# EAGLE design calibrator-test (EAGLE 9.4.1)
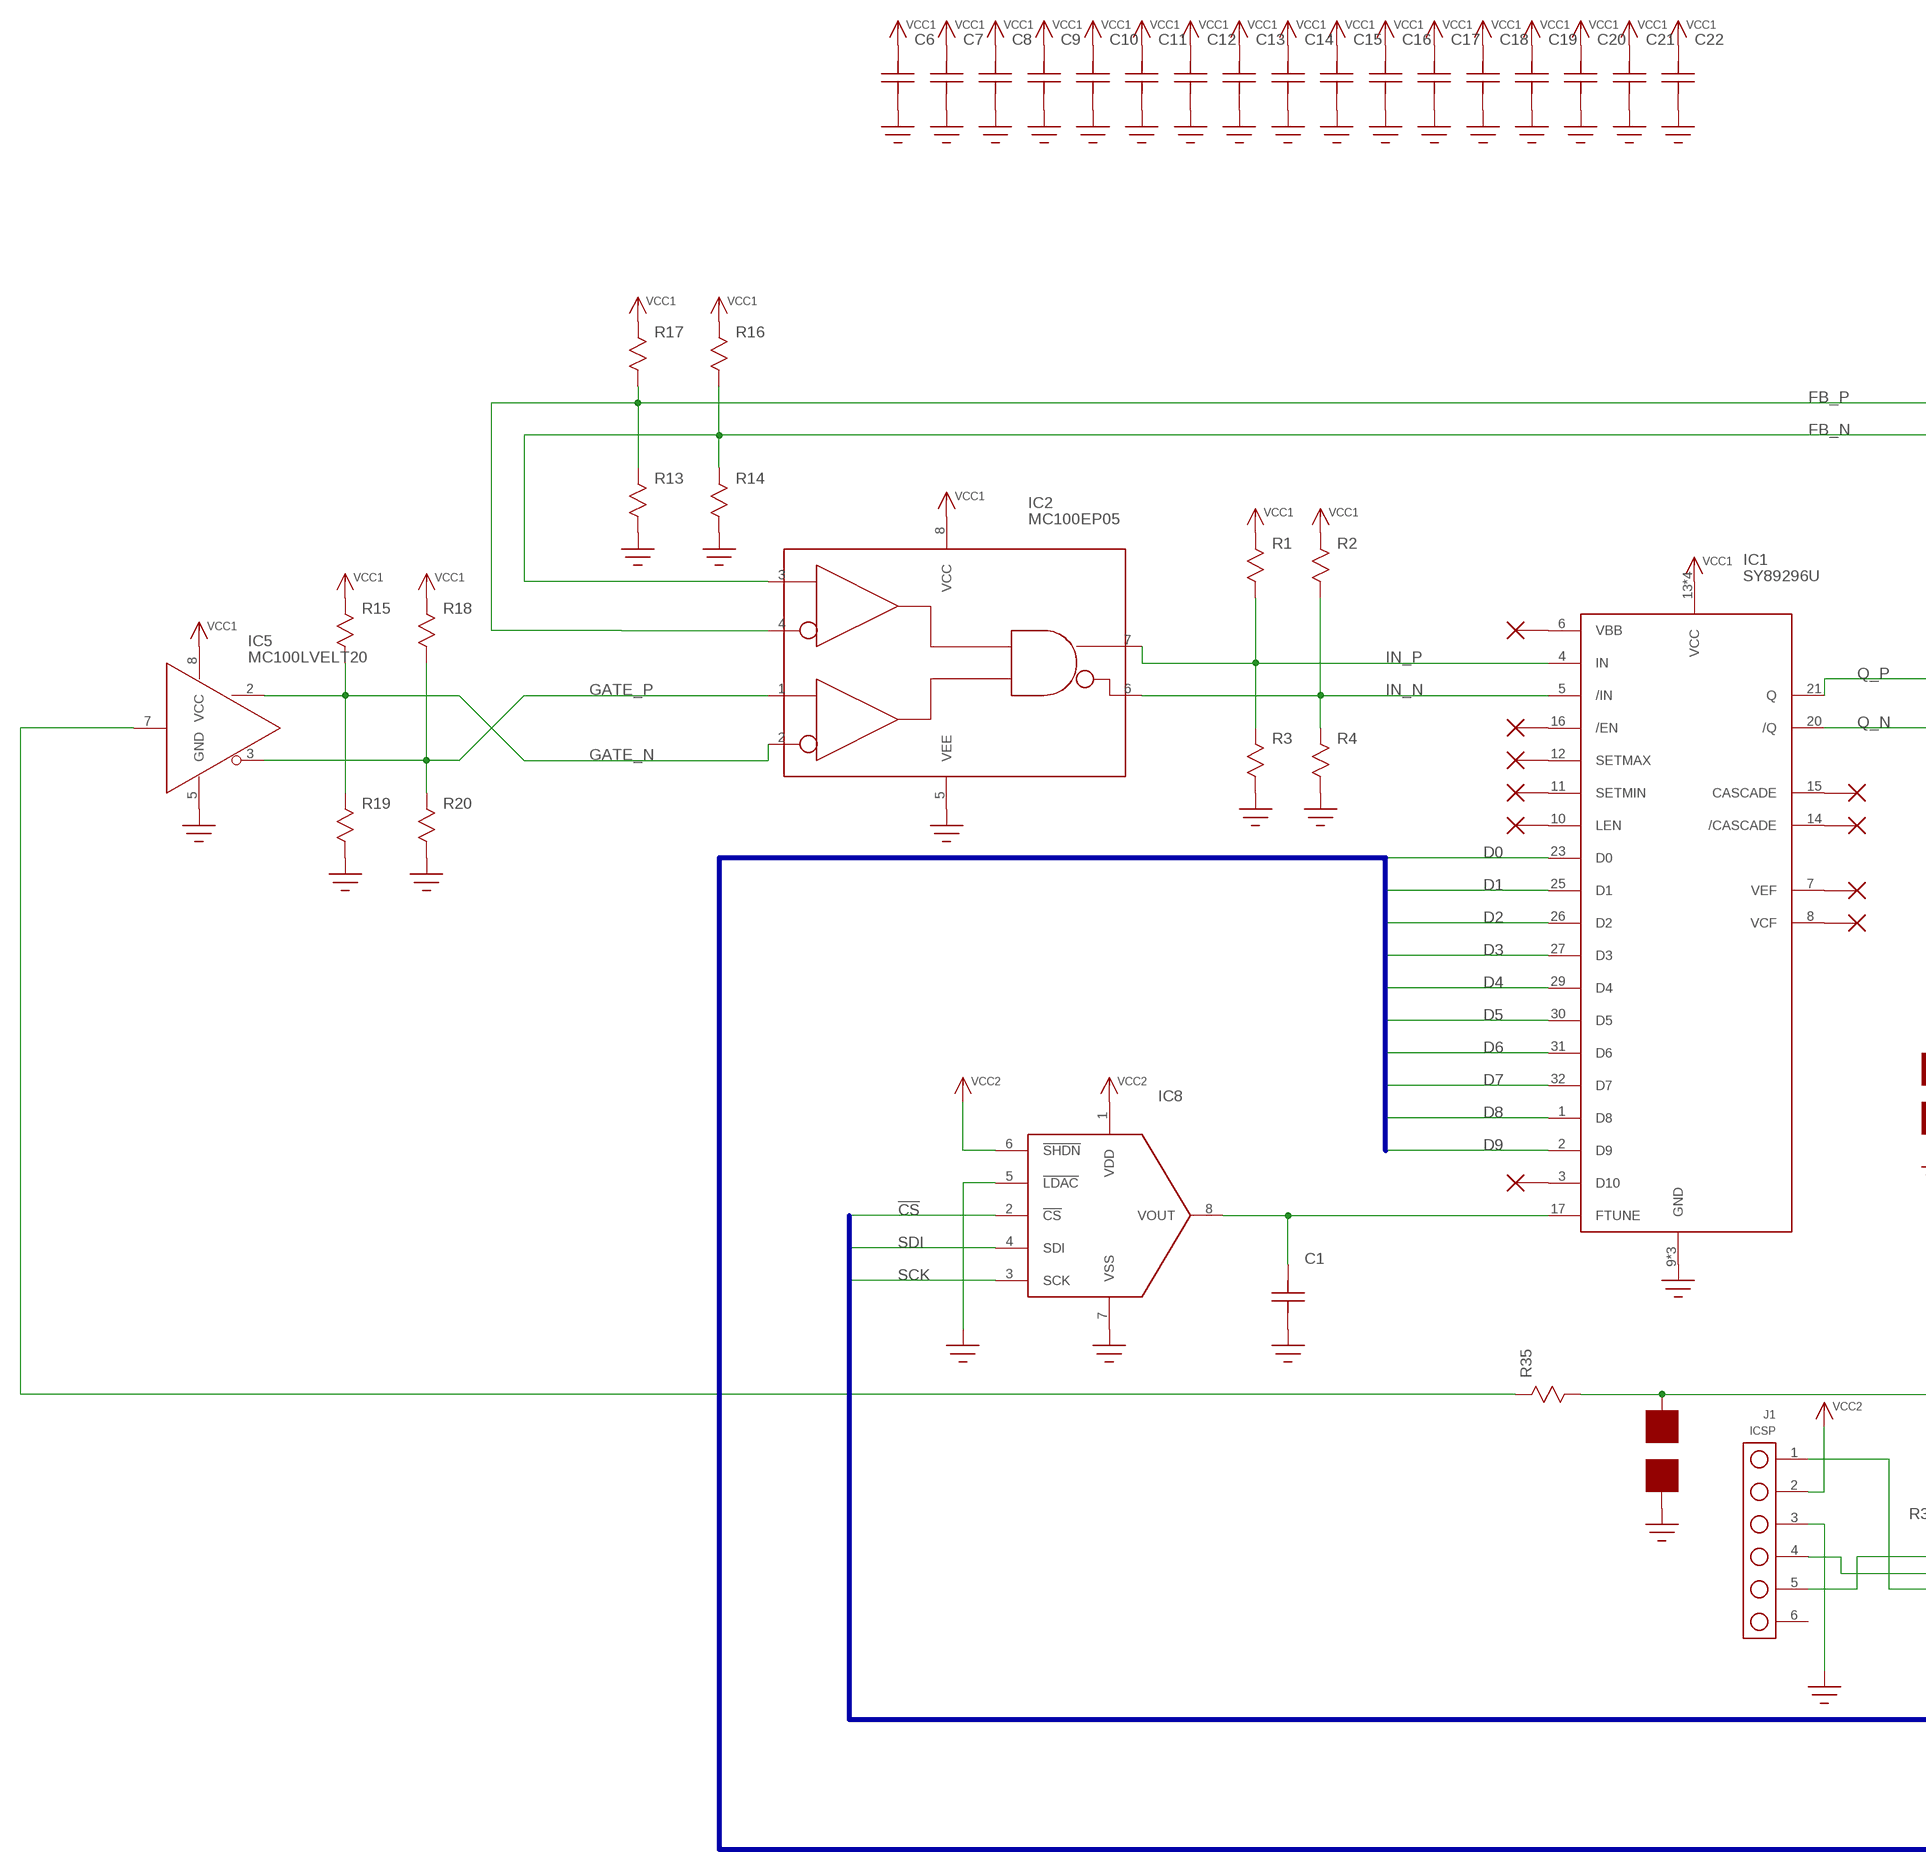
[diagram p0: schematic, sheet 1, part 1 of 2]
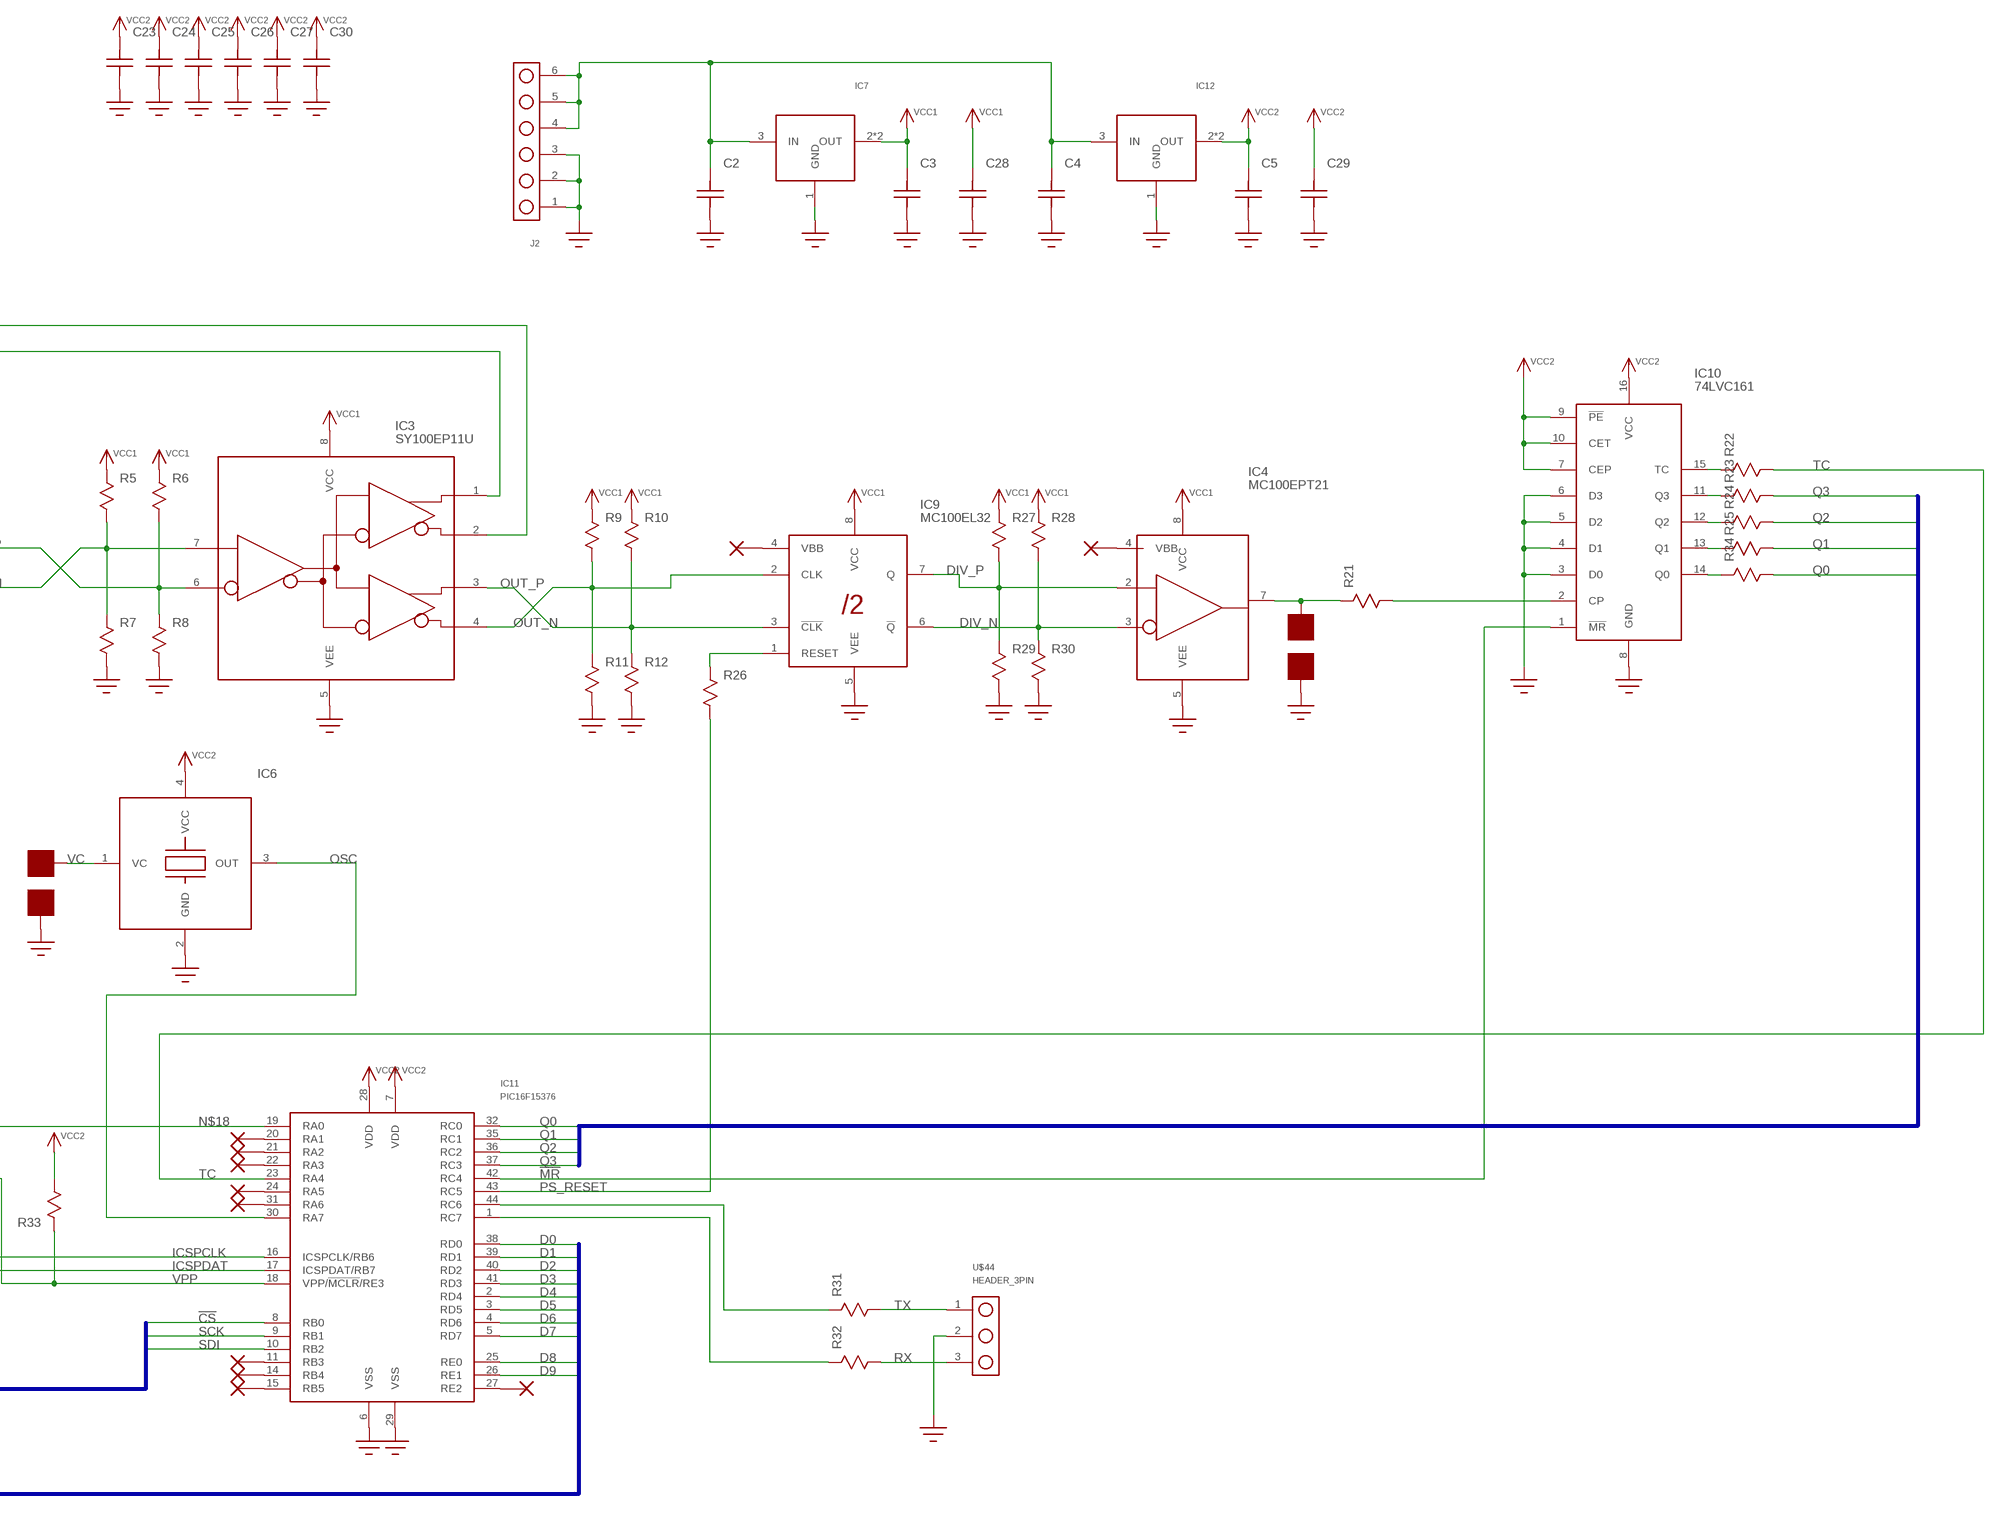
[diagram p1: schematic, sheet 1, part 2 of 2]

## Parts
C1  C0603  [C0603]
C2  C1206  [1206]
C3  C1206  [1206]
C4  C1206  [1206]
C5  C1206  [1206]
C6  C0603  [C0603]
C7  C0603  [C0603]
C8  C0603  [C0603]
C9  C0603  [C0603]
C10  C0603  [C0603]
C11  C0603  [C0603]
C12  C0603  [C0603]
C13  C0603  [C0603]
C14  C0603  [C0603]
C15  C0603  [C0603]
C16  C0603  [C0603]
C17  C0603  [C0603]
C18  C0603  [C0603]
C19  C0603  [C0603]
C20  C0603  [C0603]
C21  C0603  [C0603]
C22  C0603  [C0603]
C23  C0603  [C0603]
C24  C0603  [C0603]
C25  C0603  [C0603]
C26  C0603  [C0603]
C27  C0603  [C0603]
C28  C1206  [1206]
C29  C1206  [1206]
C30  C0603  [C0603]
IC1  SY89296U  [TQFP32_7X7]
IC2  MC100EP05  SY10EP05V  [SOIC8]
IC3  SY100EP11U  SY10EP11U  [SOIC8]
IC4  MC100EPT21  [SOIC8]
IC5  MC100LVELT20  [SOIC8]
IC6  XTAL_OSC_VC  [XTAL_3.2X5]
IC7  AZ1117E  [SOT-223]
IC8  MCP48X1  [SOIC8]
IC9  MC100EL32  [SOIC8]
IC10  74LVC161  74XX161  [SOIC-16]
IC11  PIC16F15376  [TQFP44]
IC12  AZ1117E  [SOT-223]
J1  ICSP  HEADER_6PIN  [HEADER_6PIN]
J2  HEADER_6PIN  [HEADER_6PIN]
R1  R0603  [R0603]
R2  R0603  [R0603]
R3  R0603  [R0603]
R4  R0603  [R0603]
R5  R0603  [R0603]
R6  R0603  [R0603]
R7  R0603  [R0603]
R8  R0603  [R0603]
R9  R0603  [R0603]
R10  R0603  [R0603]
R11  R0603  [R0603]
R12  R0603  [R0603]
R13  R0603  [R0603]
R14  R0603  [R0603]
R15  R0603  [R0603]
R16  R0603  [R0603]
R17  R0603  [R0603]
R18  R0603  [R0603]
R19  R0603  [R0603]
R20  R0603  [R0603]
R21  R0603  [R0603]
R22  R0603  [R0603]
R23  R0603  [R0603]
R24  R0603  [R0603]
R25  R0603  [R0603]
R26  R0603  [R0603]
R27  R0603  [R0603]
R28  R0603  [R0603]
R29  R0603  [R0603]
R30  R0603  [R0603]
R31  R0603  [R0603]
R32  R0603  [R0603]
R33  R0603  [R0603]
R34  R0603  [R0603]
R35  R0603  [R0603]
U$31  NO_CONNECT  (no package)
U$32  NO_CONNECT  (no package)
U$33  NO_CONNECT  (no package)
U$34  NO_CONNECT  (no package)
U$35  NO_CONNECT  (no package)
U$36  NO_CONNECT  (no package)
U$37  NO_CONNECT  (no package)
U$44  HEADER_3PIN  [HEADER_3PIN]
U$48  PAD50MIL  [PAD_50MIL]
U$49  NO_CONNECT  (no package)
U$50  NO_CONNECT  (no package)
U$51  NO_CONNECT  (no package)
U$57  NO_CONNECT  (no package)
U$61  NO_CONNECT  (no package)
U$62  NO_CONNECT  (no package)
U$65  NO_CONNECT  (no package)
U$66  NO_CONNECT  (no package)
U$72  NO_CONNECT  (no package)
U$73  NO_CONNECT  (no package)
U$74  NO_CONNECT  (no package)
U$75  PAD50MIL  [PAD_50MIL]
U$76  PAD50MIL  [PAD_50MIL]
U$77  PAD50MIL  [PAD_50MIL]
U$78  PAD50MIL  [PAD_50MIL]
U$81  PAD50MIL  [PAD_50MIL]
U$84  NO_CONNECT  (no package)
U$85  NO_CONNECT  (no package)
U$86  NO_CONNECT  (no package)

## Nets
!CS!: IC8.2(!CS!) IC11.8(RB0)
!GATE!: IC5.7(D) R35.P$1
!MR!: IC10.1(!MR!) IC11.42(RC4)
D0: IC1.23(D0) IC11.38(RD0)
D1: IC1.25(D1) IC11.39(RD1)
D2: IC1.26(D2) IC11.40(RD2)
D3: IC1.27(D3) IC11.41(RD3)
D4: IC1.29(D4) IC11.2(RD4)
D5: IC1.30(D5) IC11.3(RD5)
D6: IC1.31(D6) IC11.4(RD6)
D7: IC1.32(D7) IC11.5(RD7)
D8: IC1.1(D8) IC11.25(RE0)
D9: IC1.2(D9) IC11.26(RE1)
DIV_N [diff-pair]: IC4.3(!D!) IC9.6(!Q!) R28.P$2 R30.P$1
DIV_P [diff-pair]: IC4.2(D) IC9.7(Q) R27.P$2 R29.P$1
FB_N [diff-pair]: IC2.3(D1) IC3.1(Q0) R14.P$1 R16.P$2
FB_P [diff-pair]: IC2.4(!D1!) IC3.2(!Q0!) R13.P$1 R17.P$2
GATE_N [diff-pair]: IC2.2(!D0!) IC5.2(Q) R15.P$2 R19.P$1
GATE_P [diff-pair]: IC2.1(D0) IC5.3(!Q!) R18.P$2 R20.P$1
GND: C1.P$1 C2.P$1 C3.P$1 C4.P$1 C5.P$1 C6.P$1 C7.P$1 C8.P$1 C9.P$1 C10.P$1 C11.P$1 C12.P$1 C13.P$1 C14.P$1 C15.P$1 C16.P$1 C17.P$1 C18.P$1 C19.P$1 C20.P$1 C21.P$1 C22.P$1 C23.P$1 C24.P$1 C25.P$1 C26.P$1 C27.P$1 C28.P$1 C29.P$1 C30.P$1 IC1.9(GND) IC1.24(GND) IC1.28(GND) IC2.5(VEE) IC3.5(VEE) IC4.5(VEE) IC5.5(GND) IC6.2(GND) IC7.1(GND) IC8.5(!LDAC!) IC8.7(VSS) IC9.5(VEE) IC10.3(D0) IC10.4(D1) IC10.5(D2) IC10.6(D3) IC10.8(GND) IC11.6(VSS) IC11.29(VSS) IC12.1(GND) J1.3 J2.1 J2.2 J2.3 R3.P$2 R4.P$2 R7.P$2 R8.P$2 R11.P$2 R12.P$2 R13.P$2 R14.P$2 R19.P$2 R20.P$2 R29.P$2 R30.P$2 U$44.2 U$76.P$1 U$78.P$1 U$81.P$1
ICSPCLK: IC11.16(ICSPCLK/RB6) J1.5
ICSPDAT: IC11.17(ICSPDAT/RB7) J1.4
IN_N [diff-pair]: IC1.5(/IN) IC2.6(!Q!) R2.P$2 R4.P$1
IN_P [diff-pair]: IC1.4(IN) IC2.7(Q) R1.P$2 R3.P$1
N$1: IC1.3(D10) U$37.P$1
N$2: IC1.10(LEN) U$36.P$1
N$3: IC1.11(SETMIN) U$84.P$1
N$4: IC1.12(SETMAX) U$85.P$1
N$5: IC1.16(/EN) U$86.P$1
N$6: IC10.2(CP) R21.P$2
N$7: IC10.15(TC) R22.P$1
N$8: IC10.11(Q3) R23.P$1
N$9: IC10.12(Q2) R24.P$1
N$10: IC9.4(VBB) U$65.P$1
N$11: IC1.7(VEF) U$31.P$1
N$12: IC1.8(VCF) U$32.P$1
N$13: IC1.14(/CASCADE) U$33.P$1
N$14: IC1.15(CASCADE) U$34.P$1
N$15: IC1.6(VBB) U$35.P$1
N$16: IC10.13(Q1) R25.P$1
N$17: IC10.14(Q0) R34.P$1
N$18: IC11.19(RA0) R35.P$2 U$75.P$1
N$20: IC11.44(RC6) R31.P$1
N$21: IC11.1(RC7) R32.P$1
N$23: C2.P$2 C4.P$2 IC7.3(IN) IC12.3(IN) J2.4 J2.5 J2.6
N$24: IC11.20(RA1) U$49.P$1
N$25: IC11.21(RA2) U$50.P$1
N$26: IC11.22(RA3) U$57.P$1
N$27: IC11.24(RA5) U$61.P$1
N$28: IC4.4(VBB) U$51.P$1
N$29: C1.P$2 IC1.17(FTUNE) IC8.8(VOUT)
N$32: IC11.31(RA6) U$62.P$1
N$34: IC9.1(RESET) R26.P$1
N$36: IC4.7(Q) R21.P$1 U$77.P$1
N$37: IC11.11(RB3) U$66.P$1
N$38: IC11.14(RB4) U$72.P$1
N$39: IC11.15(RB5) U$73.P$1
N$40: IC11.27(RE2) U$74.P$1
OSC: IC6.3(OUT) IC11.30(RA7)
OUT_N [diff-pair]: IC3.4(!Q1!) IC9.2(CLK) R9.P$2 R11.P$1
OUT_P [diff-pair]: IC3.3(Q1) IC9.3(!CLK!) R10.P$2 R12.P$1
PS_RESET: IC11.43(RC5) R26.P$2
Q0: IC11.32(RC0) R34.P$2
Q1: IC11.35(RC1) R25.P$2
Q2: IC11.36(RC2) R24.P$2
Q3: IC11.37(RC3) R23.P$2
Q_N [diff-pair]: IC1.20(/Q) IC3.7(D) R5.P$2 R7.P$1
Q_P [diff-pair]: IC1.21(Q) IC3.6(!D!) R6.P$2 R8.P$1
RX: R32.P$2 U$44.3
SCK: IC8.3(SCK) IC11.9(RB1)
SDI: IC8.4(SDI) IC11.10(RB2)
TC: IC11.23(RA4) R22.P$2
TX: R31.P$2 U$44.1
VC: IC6.1(VC) U$48.P$1
VCC1: C3.P$2 C6.P$2 C7.P$2 C8.P$2 C9.P$2 C10.P$2 C11.P$2 C12.P$2 C13.P$2 C14.P$2 C15.P$2 C16.P$2 C17.P$2 C18.P$2 C19.P$2 C20.P$2 C21.P$2 C22.P$2 C28.P$2 IC1.13(VCC) IC1.18(VCC) IC1.19(VCC) IC1.22(VCC) IC2.8(VCC) IC3.8(VCC) IC4.8(VCC) IC5.8(VCC) IC7.2(OUT) IC7.4(OUT) IC9.8(VCC) R1.P$1 R2.P$1 R5.P$1 R6.P$1 R9.P$1 R10.P$1 R15.P$1 R16.P$1 R17.P$1 R18.P$1 R27.P$1 R28.P$1
VCC2: C5.P$2 C23.P$2 C24.P$2 C25.P$2 C26.P$2 C27.P$2 C29.P$2 C30.P$2 IC6.4(VCC) IC8.1(VDD) IC8.6(!SHDN!) IC10.7(CEP) IC10.9(!PE!) IC10.10(CET) IC10.16(VCC) IC11.7(VDD) IC11.28(VDD) IC12.2(OUT) IC12.4(OUT) J1.2 R33.P$2
VPP: IC11.18(VPP/!MCLR!/RE3) J1.1 R33.P$1
Unconnected: J1.6

## Buses
D0,D1,D2,D3,D4,D5,D6,D7,D8,D9
Q0,Q1,Q2,Q3
!CS!,SCK,SDI

## Library data of the parts
C1-C30 = yapo:C
IC1 = yapo:SY89296U
IC2 = yapo:SY10EP05V
IC3 = yapo:SY10EP11U
IC4 = yapo:MC100EPT21
IC5 = yapo:MC100LVELT20
IC6 = yapo:XTAL_OSC_VC
IC7 IC12 = yapo:AZ1117E
IC8 = yapo:MCP48X1
IC9 = yapo:MC100EL32
IC10 = yapo:74XX161
IC11 = yapo:PIC16F15376
J1 J2 = yapo:HEADER_6PIN
R1-R35 = yapo:R
U$31-U$37 U$49-U$51 U$57 U$61 U$62 U$65 U$66 U$72-U$74 U$84-U$86 = yapo:NO_CONNECT
U$44 = yapo:HEADER_3PIN
U$48 U$75-U$78 U$81 = yapo:PAD

## Net classes
1 diff-pair: width 0.356 mm, clearance 0.254 mm

## Board
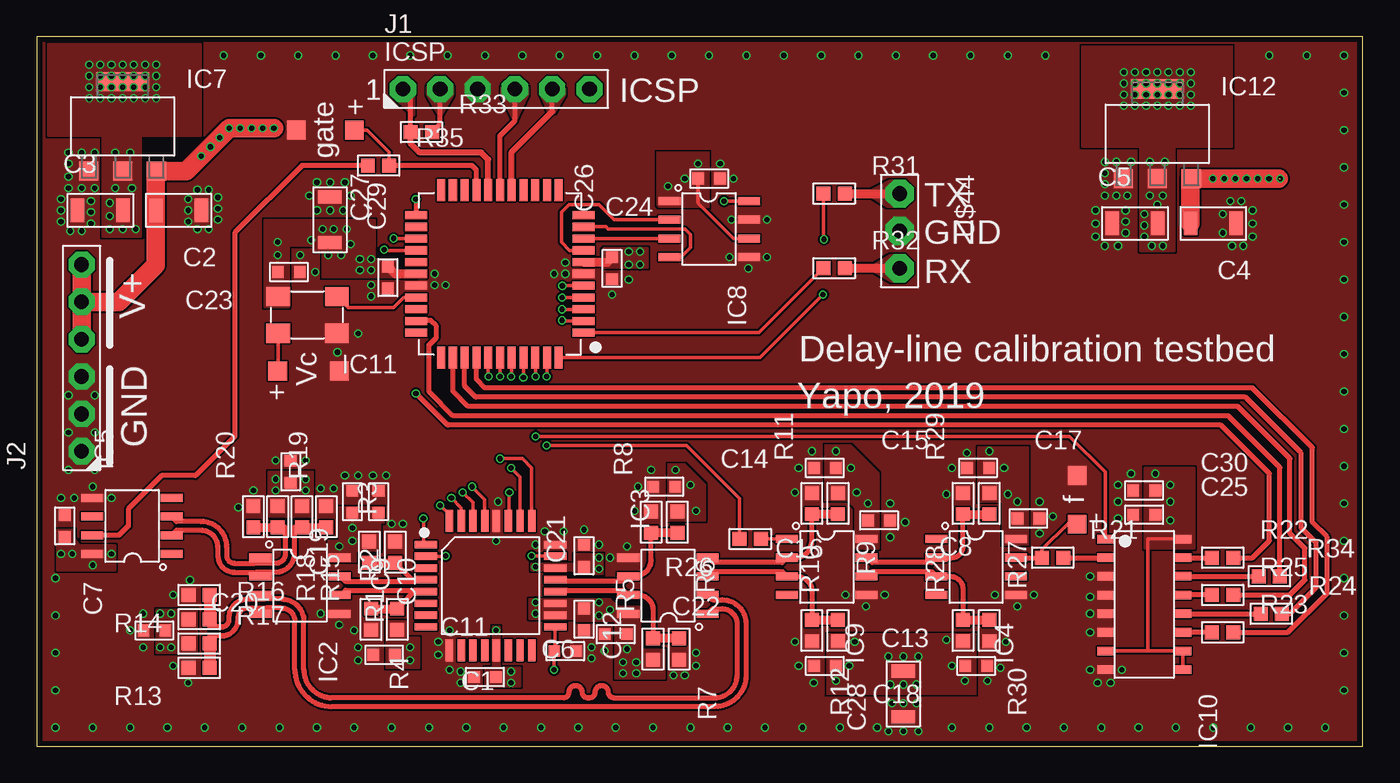
[diagram p2: board, top side]
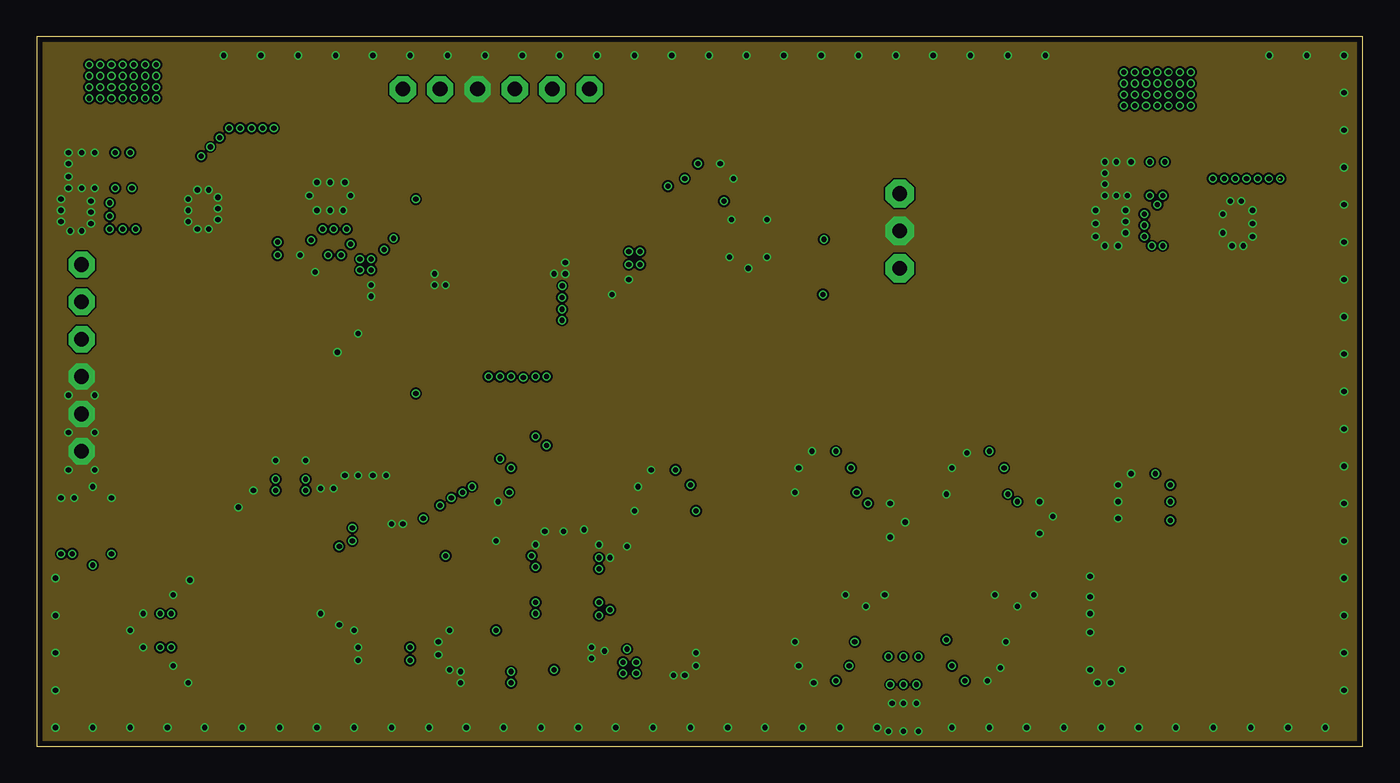
[diagram p3: board, inner layer Route2]
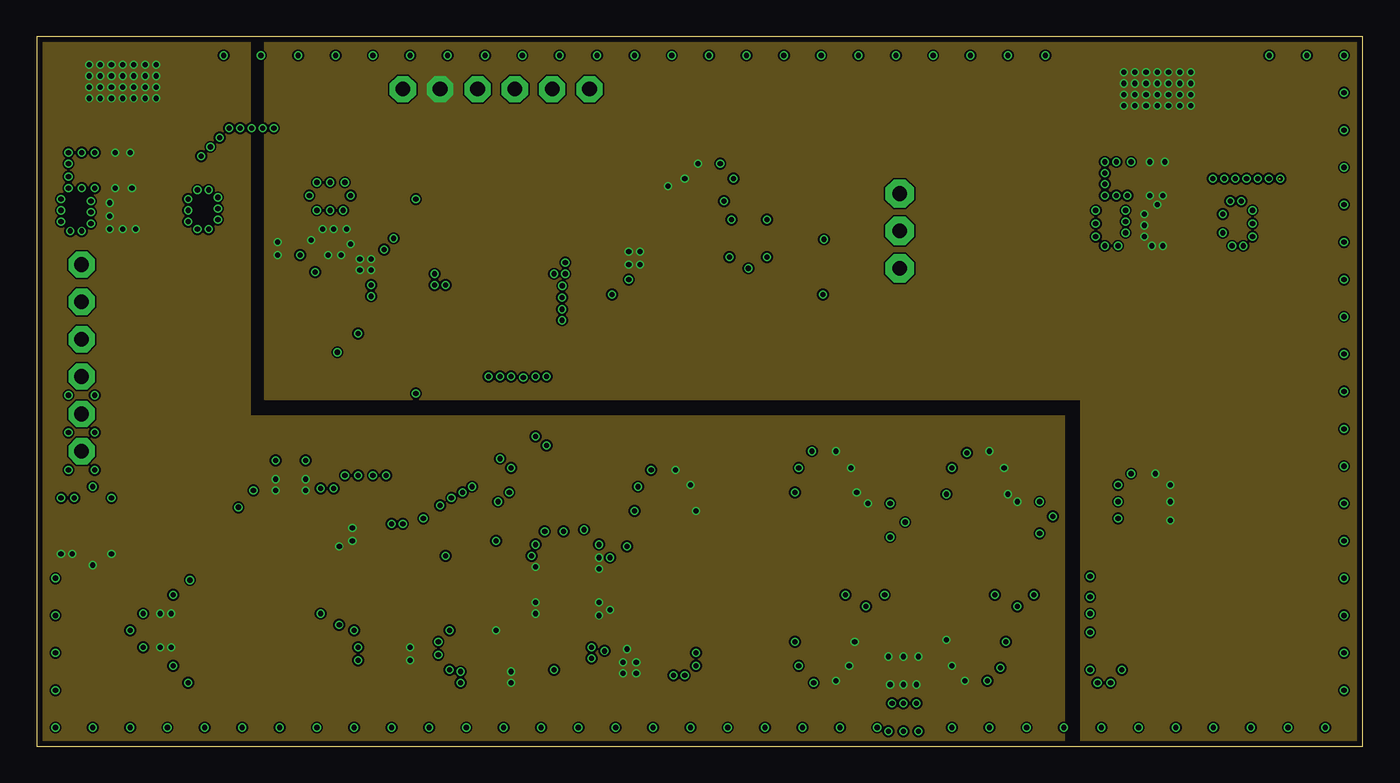
[diagram p4: board, inner layer Route15]
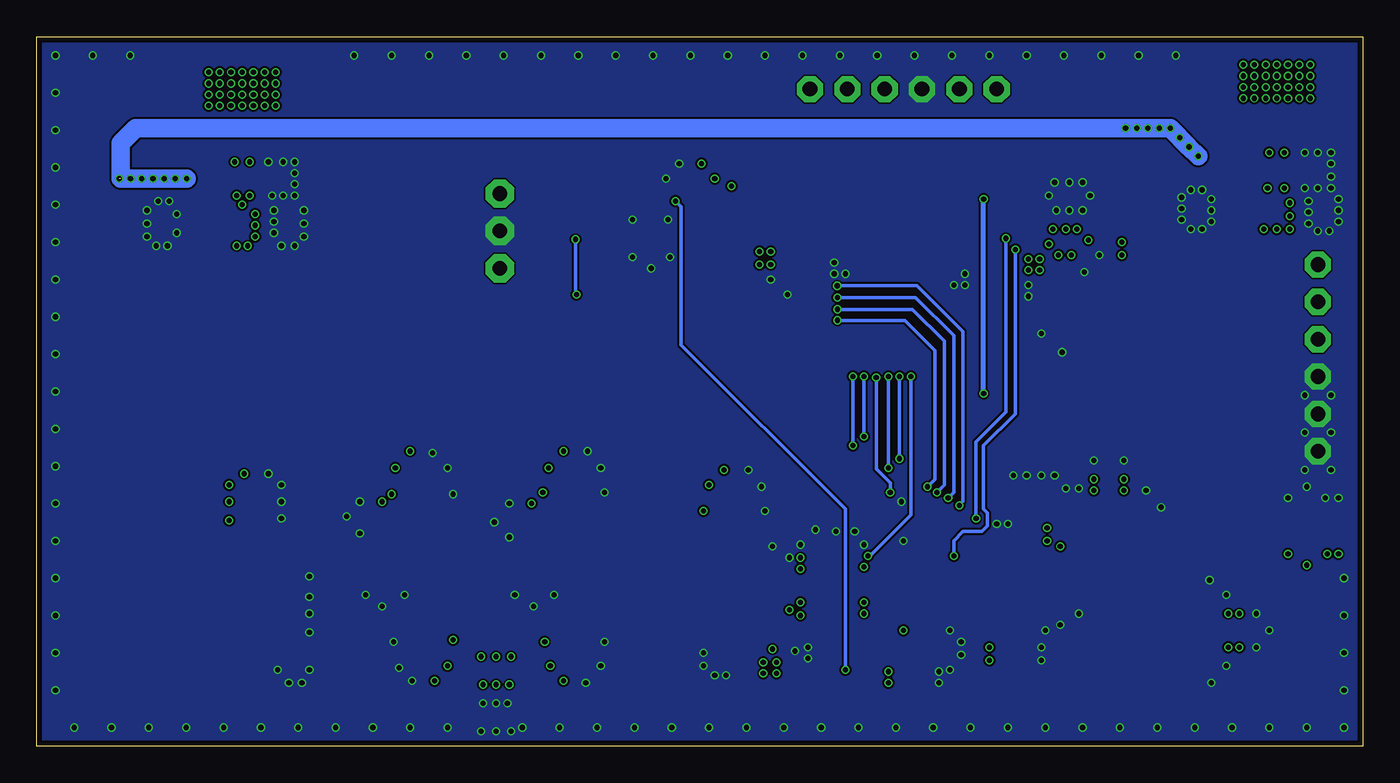
[diagram p5: board, bottom side, seen from below]

Size 90.17 x 48.26 mm. Coordinates in mm from the lower left corner, seen from the top.
Outline: 0,0 90.17,0 90.17,48.26 0,48.26 0,0
Copper layers (1*2*15*16): Top 0.035559375mm / dielectric 0.17018125mm / Route2 0.01778125mm / dielectric 47mil / Route15 0.01778125mm / dielectric 0.17018125mm / Bottom 0.035559375mm
Design rules "oshpark-4layer *": minimum track width 5mil, minimum drill 10mil, track to track 5mil, track to pad 5mil, pad to pad 5mil, via to via 5mil, smd to smd 5mil, copper to edge 15mil, drill to drill 6mil, minimum pad ring 4mil, minimum via ring 4mil, stop-mask expansion 2.5mil, vias tented up to drill 20mil, thermal gap 10mil

### Footprints (pad centres in the part's own frame; a part is rotated, then mirrored left to right if it is on the bottom)
C0603 = smd 0.8 x 0.8: P$1 -0.75,0; P$2 0.75,0
1206 = smd 0.9 x 1.6: P$1 -1.55,0; P$2 1.55,0
TQFP32_7X7 = smd 1.5 x 0.5: 1 -4.4,2.8; 2 -4.4,2; 3 -4.4,1.2; 4 -4.4,0.4; 5 -4.4,-0.4; 6 -4.4,-1.2; 7 -4.4,-2; 8 -4.4,-2.8; 17 4.4,-2.8; 18 4.4,-2; 19 4.4,-1.2; 20 4.4,-0.4; 21 4.4,0.4; 22 4.4,1.2; 23 4.4,2; 24 4.4,2.8 | smd 0.5 x 1.5: 9 -2.8,-4.4; 10 -2,-4.4; 11 -1.2,-4.4; 12 -0.4,-4.4; 13 0.4,-4.4; 14 1.2,-4.4; 15 2,-4.4; 16 2.8,-4.4; 25 2.8,4.4; 26 2,4.4; 27 1.2,4.4; 28 0.4,4.4; 29 -0.4,4.4; 30 -1.2,4.4; 31 -2,4.4; 32 -2.8,4.4
SOIC8 = smd 0.55 x 1.5: 1 -1.905,-2.7; 2 -0.635,-2.7; 3 0.635,-2.7; 4 1.905,-2.7; 5 1.905,2.7; 6 0.635,2.7; 7 -0.635,2.7; 8 -1.905,2.7
XTAL_3.2X5 = smd 1.6 x 1.3: 1 -2,-1.25; 2 2,-1.25; 3 2,1.25; 4 -2,1.25
SOT-223 = smd 1.3 x 1.3: 1 -2.3,-3.05; 2 0,-3.05; 3 2.3,-3.05 | smd 3.6 x 1.3: 4 0,3.05
SOIC-16 = smd 0.58 x 1.12: 1 -4.445,-2.64; 2 -3.175,-2.64; 3 -1.905,-2.64; 4 -0.635,-2.64; 5 0.635,-2.64; 6 1.905,-2.64; 7 3.175,-2.64; 8 4.445,-2.64; 9 4.445,2.64; 10 3.175,2.64; 11 1.905,2.64; 12 0.635,2.64; 13 -0.635,2.64; 14 -1.905,2.64; 15 -3.175,2.64; 16 -4.445,2.64
TQFP44 = smd 1.5 x 0.55: 1 -5.7,4; 2 -5.7,3.2; 3 -5.7,2.4; 4 -5.7,1.6; 5 -5.7,0.8; 6 -5.7,0; 7 -5.7,-0.8; 8 -5.7,-1.6; 9 -5.7,-2.4; 10 -5.7,-3.2; 11 -5.7,-4; 23 5.7,-4; 24 5.7,-3.2; 25 5.7,-2.4; 26 5.7,-1.6; 27 5.7,-0.8; 28 5.7,0; 29 5.7,0.8; 30 5.7,1.6; 31 5.7,2.4; 32 5.7,3.2; 33 5.7,4 | smd 0.55 x 1.5: 12 -4,-5.7; 13 -3.2,-5.7; 14 -2.4,-5.7; 15 -1.6,-5.7; 16 -0.8,-5.7; 17 0,-5.7; 18 0.8,-5.7; 19 1.6,-5.7; 20 2.4,-5.7; 21 3.2,-5.7; 22 4,-5.7; 34 4,5.7; 35 3.2,5.7; 36 2.4,5.7; 37 1.6,5.7; 38 0.8,5.7; 39 0,5.7; 40 -0.8,5.7; 41 -1.6,5.7; 42 -2.4,5.7; 43 -3.2,5.7; 44 -4,5.7
HEADER_6PIN = drill 1 pad 1.778 octagon: 1 -6.35,0; 2 -3.81,0; 3 -1.27,0; 4 1.27,0; 5 3.81,0; 6 6.35,0
R0603 = smd 0.95 x 0.95: P$1 -0.725,0; P$2 0.725,0
HEADER_3PIN = drill 1 pad 1.93 octagon: 1 -2.54,0; 2 0,0; 3 2.54,0
PAD_50MIL = smd 1.27 x 1.27: P$1 0,0

### Placement (x,y rotation side)
C1  35.94,6.48 180 top
C2  9.65,36.45 180 top
C3  4.32,36.45 0 top
C4  80.01,35.56 180 top
C5  74.68,35.56 0 top
C6  30.48,4.7 0 top
C7  1.91,14.99 270 top
C8  67.44,15.49 180 top
C9  21.46,16.64 270 top
C10  23.24,16.64 270 top
C11  23.62,6.22 0 top
C12  37.21,12.95 270 top
C13  53.59,5.46 0 top
C14  42.67,17.65 0 top
C15  53.59,18.92 0 top
C16  57.28,15.37 180 top
C17  64.01,18.92 0 top
C18  63.88,5.46 180 top
C19  17.27,18.67 270 top
C20  8,7.87 0 top
C21  37.21,8.64 90 top
C22  39.37,7.62 0 top
C23  17.14,32.26 180 top
C24  45.72,38.61 180 top
C25  75.31,15.75 0 top
C26  39.12,32.51 90 top
C27  23.88,31.88 90 top
C28  58.93,3.56 90 top
C29  19.94,35.81 270 top
C30  75.31,17.4 0 top
IC1  30.86,10.92 0 top
IC2  17.91,10.92 270 top
IC3  42.93,10.92 90 top
IC4  63.88,12.19 270 top
IC5  6.48,14.99 90 top
IC6  18.41,29.34 0 top
IC7  5.84,42.16 0 top
IC8  45.72,35.18 270 top
IC9  53.72,12.19 270 top
IC10  75.31,9.65 270 top
IC11  31.5,32.13 180 top
IC12  76.2,41.66 0 top
J1  31.24,44.7 0 top
J2  3.05,26.42 90 top
R1  22.61,13.21 270 top
R2  24.51,8.64 90 top
R3  24.38,13.21 90 top
R4  22.73,8.64 270 top
R5  41.91,6.6 90 top
R6  43.56,15.24 270 top
R7  43.69,6.6 270 top
R8  41.78,15.24 90 top
R9  54.48,16.51 270 top
R10  54.48,7.87 90 top
R11  52.7,16.51 90 top
R12  52.7,7.87 270 top
R13  11.05,5.33 180 top
R14  11.05,10.29 180 top
R15  18.03,15.62 270 top
R16  11.05,8.64 0 top
R17  11.05,6.99 0 top
R18  16.38,15.62 270 top
R19  19.68,15.62 90 top
R20  14.73,15.62 90 top
R21  69.09,12.83 0 top
R22  80.64,12.83 0 top
R23  80.64,7.75 0 top
R24  83.95,9.02 0 top
R25  80.64,10.29 0 top
R26  48.51,14.1 180 top
R27  64.77,16.51 270 top
R28  62.99,7.87 90 top
R29  62.99,16.51 90 top
R30  64.77,7.87 270 top
R31  54.23,37.59 0 top
R32  54.23,32.51 0 top
R33  26.16,41.78 0 top
R34  83.82,11.56 0 top
R35  23.24,39.5 0 top
U$44  58.67,35.05 270 top
U$48  16.38,25.53 0 top
U$75  21.59,41.91 0 top
U$76  17.65,41.91 0 top
U$77  70.74,15.11 0 top
U$78  70.74,18.41 0 top
U$81  20.57,25.53 0 top

### Tracks (layer width: path | path; a pad name or v marks a point on that pad's centre or on a via)
!CS!
  Top 0.254: IC11.8 36.25,33.73 35.69,34.29 35.69,36.32 36.2,36.83 38.23,36.83 39.24,35.81 IC8.2
!GATE!
  Top 0.356: R35.P$1 18.03,39.5 13.46,34.92 13.46,21.08 10.79,18.41 8.51,18.41 6.22,16.13 6.22,14.99 5.59,14.35 IC5.7
!MR!  (via drill 0.35)
  Top 0.254: IC11.42 33.91,26.42 v33.91,25.15 | v33.91,21.08 70.23,21.08 72.67,18.64 IC10.1
  Bottom 0.254: v33.91,25.15 v33.91,21.08
D0  (via drill 0.35)
  Top 0.254: IC11.38 30.7,25.18 v30.73,25.15 | v33.66,12.95 35.23,12.95 IC1.23
  Bottom 0.254: v30.73,25.15 30.73,15.75 33.53,12.95 v33.66,12.95
D1  (via drill 0.35)
  Top 0.254: IC11.39 v31.5,25.15 | v31.5,19.56 33.02,19.56 33.66,18.92 IC1.25
  Bottom 0.254: v31.5,25.15 v31.5,19.56
D2  (via drill 0.35)
  Top 0.254: IC11.40 32.3,25.18 v32.26,25.15 | v32.26,18.92 32.86,18.32 IC1.26
  Bottom 0.254: v32.26,25.15 v32.26,18.92
D3  (via drill 0.35)
  Top 0.254: IC11.41 33.1,25.09 v33.08,25.08 | v32.13,17.27 32.13,15.39 IC1.27
  Bottom 0.254: v33.08,25.08 33.08,18.86 32.13,17.91 v32.13,17.27
D4  (via drill 0.35)
  Top 0.254: IC11.2 35.76,28.93 v35.73,28.97 | v29.59,17.65 30.46,16.78 IC1.29
  Bottom 0.254: v35.73,28.97 31.13,28.97 29.08,26.92 29.08,18.16 v29.59,17.65
D5  (via drill 0.35)
  Top 0.254: IC11.3 37.18,29.72 v35.71,29.72 | v28.96,17.27 29.66,16.57 IC1.30
  Bottom 0.254: v35.71,29.72 30.61,29.72 28.45,27.56 28.45,17.78 v28.96,17.27
D6  (via drill 0.35)
  Top 0.254: IC11.4 v35.71,30.53 | v28.19,16.89 28.86,16.22 IC1.31
  Bottom 0.254: v35.71,30.53 30.4,30.53 27.81,27.94 27.81,17.27 v28.19,16.89
D7  (via drill 0.35)
  Top 0.254: IC11.5 v35.75,31.33 v35.74,31.32 | v27.43,16.38 28.06,15.75 IC1.32
  Bottom 0.254: v35.74,31.32 30.3,31.32 27.18,28.19 27.18,16.64 v27.43,16.38
D8  (via drill 0.35)
  Top 0.254: IC11.25 24.4,34.53 24.38,34.54 v24.26,34.54 | v26.29,15.49 26.29,13.89 IC1.1
  Bottom 0.254: v24.26,34.54 24.26,22.73 26.29,20.7 v26.29,15.49
D9  (via drill 0.35)
  Top 0.254: IC11.26 23.67,33.73 v23.62,33.78 | v27.81,12.95 27.78,12.92 IC1.2
  Bottom 0.254: v23.62,33.78 23.62,22.61 25.78,20.45 25.78,16.13 25.53,15.88 25.53,14.99 25.91,14.61 27.18,14.61 27.81,13.97 v27.81,12.95
DIV_N
  Top 0.356: IC9.6 56.48,11.56 56.81,11.89 60.83,11.89 61.16,11.56 IC4.3 62.1,11.56 arc-90 62.99,10.67 R28.P$2
  Top 0.61: R28.P$2 R30.P$1
DIV_P
  Top 0.356: IC9.7 56.48,12.83 56.81,12.5 60.85,12.5 IC4.2 62.23,12.83 arc90 62.99,13.59 R29.P$1
  Top 0.61: R29.P$1 R27.P$2
FB_N
  Top 0.356: IC2.3 15.49,10.01 | 15.49,10.01 16.66,10.01 arc-90 18.16,8.51 18.16,5.21 arc90 20.07,3.3 35.81,3.3 arc90 36.2,3.68 arc-90 36.64,4.13 arc-90 37.08,3.68 arc90 37.47,3.3 37.59,3.3 arc90 37.97,3.68 arc-90 38.42,4.13 arc-90 38.86,3.68 arc90 39.24,3.3 46.1,3.3 arc90 47.62,4.83 47.62,8.33 arc90 46.61,9.35 45.96,9.35 IC3.1 | R16.P$2 11.77,8.12 12.57,8.12 arc90 13.08,8.62 13.08,8.76 arc-90 14.33,10.01 15.49,10.01
  Top 0.813: R14.P$1 R16.P$2
FB_P
  Top 0.356: IC2.4 15.59,9.4 | 15.59,9.4 16.66,9.4 arc-90 17.55,8.51 17.55,5.21 arc90 20.07,2.69 46.1,2.69 arc90 48.23,4.83 48.23,8.33 arc90 46.61,9.96 45.96,9.96 IC3.2 | R17.P$2 11.77,7.51 12.57,7.51 arc90 13.69,8.62 13.69,8.76 arc-90 14.33,9.4 15.59,9.4
  Top 0.813: R17.P$2 R13.P$1
GATE_N
  Top 0.356: IC5.2 9.51,14.68 11.18,14.68 arc-90 12.32,13.54 12.32,12.95 arc90 13.44,11.84 14.93,11.84 | 14.93,11.84 IC2.2 | 18.16,14.77 R15.P$2 17.51,14.9 17.51,13.09 arc-90 16.26,11.84 14.93,11.84
  Top 0.61: R15.P$2 R19.P$1
GATE_P
  Top 0.356: IC5.3 9.51,15.29 11.18,15.29 arc-90 12.93,13.54 12.93,12.95 arc90 13.44,12.45 14.83,12.45 | 14.83,12.45 IC2.1 | R18.P$2 16.9,14.9 16.9,13.09 arc-90 16.26,12.45 14.83,12.45
  Top 0.61: R20.P$1 R18.P$2 16.51,14.77
GND  (via drill 0.35)
  other vias: 39.12,30.73 40.26,31.75 35.94,32.13 27.05,31.37 27.81,31.37 35.18,32.13 27.05,32.13 35.94,32.89 22.73,31.37 22.73,30.61 20.45,26.8 21.84,28.07 17.91,33.4 18.92,32.26 18.29,19.43 47.37,38.61 46.48,39.62 48.39,32.51 49.66,33.27 73.41,39.75 74.42,39.75 72.64,39.75 72.64,38.99 72.64,38.23 72.01,36.45 72.64,37.47 73.41,37.47 72.01,35.56 72.01,34.67 72.64,34.04 74.04,36.45 74.04,34.92 82.68,36.45 82.68,35.56 82.68,34.67 81.92,37.08 82.04,34.04 80.64,36.2 80.64,34.92 28.07,7.87 33.91,13.72 31.24,13.97 31.37,16.64 34.54,14.61 35.81,14.61 37.21,14.73 38.23,13.72 38.99,12.83 40.13,13.59 40.64,16 40.89,17.65 37.72,6.73 37.72,5.97 38.61,6.48 44.83,6.35 44.83,5.46 21.59,7.87 21.84,6.73 21.84,5.84 19.3,9.02 20.57,8.26 24.89,15.11 24.13,15.11 22.86,18.41 23.75,18.41 21.84,18.41 20.95,18.41 20.19,17.53 19.3,17.53 16.26,19.43 7.24,9.02 6.35,7.87 7.24,6.73 3.81,17.65 2.54,16.89 5.08,16.89 41.78,18.8 51.56,17.27 51.82,18.92 52.7,20.07 54.99,10.29 56.39,9.53 57.66,10.29 58.04,14.22 59.05,15.24 58.04,16.51 52.83,4.32 51.82,5.46 51.56,7.11 65.91,7.11 65.53,5.33 64.64,4.45 63.25,19.94 62.23,18.92 61.85,17.14 65.15,10.29 67.82,10.29 66.67,9.53 68.2,16.64 68.2,14.48 69.09,15.62 71.63,11.56 71.63,10.16 71.63,9.02 71.63,7.75 71.63,5.21 72.14,4.32 73.79,5.21 73.53,15.49 73.53,16.64 73.53,17.78 74.42,18.54 3.05,40.39 3.94,40.39 3.94,37.97 3.05,37.97 2.16,40.39 2.16,39.62 2.16,37.97 1.65,37.21 1.65,36.45 1.65,35.69 3.68,37.08 3.68,36.32 3.68,35.56 2.29,35.05 2.16,38.73 3.05,35.05 12.32,37.34 12.32,36.58 12.32,35.81 10.29,36.45 10.29,37.21 10.29,35.69 10.92,37.85 10.92,35.18 11.68,35.18 11.68,37.85 47.24,35.81 49.66,35.81 10.41,11.3 9.27,10.29 9.27,5.46 10.29,4.32 1.65,16.89 14.73,17.4 13.72,16.26 73.03,4.32 47.12,33.27 27.3,7.11 27.3,6.22 28.83,5.08 28.83,4.32 43.31,4.83 44.07,4.83 74.17,37.47 73.53,34.04 81.15,37.08 81.28,34.04 74.04,35.69 2.16,23.88 3.94,23.88 3.94,21.34 2.16,21.34 2.16,18.8 3.94,18.8 28.07,5.21 57.91,1.02 58.93,1.02 59.94,1.02 58.93,2.92 58.17,2.92 59.82,2.92 19.05,36.45 19.94,36.45 20.83,36.45 19.94,38.35 19.05,38.35 20.95,38.35 18.54,37.47 21.34,37.47 1.27,3.81 1.27,1.27 3.81,1.27 6.35,1.27 8.89,1.27 11.43,1.27 13.97,1.27 16.51,1.27 19.05,1.27 21.59,1.27 24.13,1.27 26.67,1.27 29.21,1.27 31.75,1.27 34.29,1.27 36.83,1.27 39.37,1.27 41.91,1.27 44.45,1.27 46.99,1.27 49.53,1.27 52.07,1.27 54.61,1.27 57.15,1.27 62.23,1.27 64.77,1.27 67.31,1.27 72.39,1.27 74.93,1.27 69.85,1.27 77.47,1.27 80.01,1.27 82.55,1.27 85.09,1.27 87.63,1.27 1.27,6.35 1.27,8.89 1.27,11.43 12.7,46.99 15.24,46.99 17.78,46.99 20.32,46.99 22.86,46.99 25.4,46.99 27.94,46.99 30.48,46.99 33.02,46.99 35.56,46.99 38.1,46.99 40.64,46.99 43.18,46.99 45.72,46.99 48.26,46.99 50.8,46.99 53.34,46.99 55.88,46.99 58.42,46.99 60.96,46.99 63.5,46.99 66.04,46.99 68.58,46.99 88.9,46.99 86.36,46.99 83.82,46.99 88.9,44.45 88.9,41.91 88.9,39.37 88.9,36.83 88.9,34.29 88.9,31.75 88.9,29.21 88.9,26.67 88.9,24.13 88.9,21.59 88.9,19.05 88.9,16.51 88.9,13.97 88.9,11.43 88.9,8.89 88.9,6.35 88.9,3.81
  pour Top (rank 2, no thermals): 0,0 90.17,0 90.17,48.26 0,48.26
  pour Bottom (rank 2, no thermals): 0,0 90.17,0 90.17,48.26 0,48.26
  pour Route2 (no thermals): 0,0 90.17,0 90.17,48.26 0,48.26
ICSPCLK
  Top 0.356: 35.05,43.18 J1.5
  Top 0.406: IC11.16 32.3,40.42 35.05,43.18
  pour Top (no thermals): 34.29,44.7 35.94,44.7 35.94,44.32 35.18,43.05 34.8,43.05 34.29,44.32
ICSPDAT
  Top 0.356: IC11.17 31.5,41.53 32.51,42.55 J1.4
  pour Top (no thermals): 31.62,44.83 33.4,44.83 33.4,44.32 32.51,42.42 31.62,44.2
IN_N
  Top 0.356: IC2.6 20.67,10.29 21,10.62 25.7,10.62 25.8,10.52 IC1.5 25.67,10.52 25.55,10.4 25.53,10.4 25.28,10.15 25.28,10.13 R2.P$2 24.51,9.6
  Top 0.61: R4.P$1 R2.P$2
IN_P
  Top 0.356: IC2.7 20.67,11.56 21,11.23 25.7,11.23 25.8,11.32 | 25.8,11.32 IC1.4 | R3.P$1 25.55,11.32 25.8,11.32
  Top 0.61: R1.P$2 R3.P$1
N$6
  Top 0.356: R21.P$2 IC10.2
N$7
  Top 0.356: IC10.15 R22.P$1
N$8
  Top 0.356: R23.P$1 IC10.11
N$9
  Top 0.356: IC10.12 R24.P$1
N$16
  Top 0.356: R25.P$1 IC10.13
N$17
  Top 0.356: IC10.14 R34.P$1
N$18
  Top 0.254: R35.P$2 23.97,40.42 22.48,41.91 U$75.P$1
  Top 0.356: IC11.19 29.9,39.19 29.59,39.5 R35.P$2
N$19
  Top 1.27: 80.01,38.61 84.45,38.61
N$20  (via drill 0.35)
  Top 0.254: R31.P$1 53.5,34.63 53.59,34.54 v53.53,34.48 | v53.47,30.73 49.16,26.43 IC11.44
  Bottom 0.254: v53.53,34.48 53.53,30.8 v53.47,30.73
N$21
  Top 0.254: IC11.1 49.12,28.13 R32.P$1
N$23  (via drill 0.35)  (2 unrouted)
  Top 1.016: 78.46,38.61 IC12.3 | 8.1,39.11 IC7.3
  Top 1.27: C4.P$2 78.46,38.61 | 8.1,39.11 C2.P$2 8.1,32.74 5.59,30.23 J2.5 | IC7.3 9.91,39.12 10.16,39.12 v13.08,42.04 v16.13,42.04 | IC12.3 v79.98,38.61 v80.75,38.61 v81.51,38.61 v82.27,38.61 v83.03,38.61 | 84.45,38.61 v83.79,38.61 | J2.5 J2.6 | J2.5 J2.4
  Bottom 1.27: v79.98,38.61 v79.99,38.61 84.45,38.61 84.45,41.02 83.44,42.04 v16.13,42.04 v15.37,42.04 | v15.37,42.04 v13.84,42.04 | v11.81,40.77 v13.08,42.04 v13.84,42.04 | v11.81,40.77 v11.18,40.13 | v12.45,41.4 v11.81,40.77 | v13.84,42.04 v14.61,42.04 v15.37,42.04
  other vias: 84.56,38.61
N$29  (via drill 0.35)
  Top 0.254: v35.18,5.21 35.18,6.46 C1.P$2 35.26,6.55 IC1.17 | IC8.8 v46.74,37.08
  Bottom 0.254: v46.74,37.08 46.35,36.7 46.35,27.3 35.18,16.13 v35.18,5.21
N$34
  Top 0.254: IC9.1 R26.P$1
N$36
  Top 0.254: R21.P$1 68.36,13.37 70.1,15.11 U$77.P$1
  Top 0.356: IC4.7 R21.P$1
OSC
  Top 0.254: IC11.30 24.94,30.53 24.26,29.84 21.16,29.84 IC6.3
OUT_N
  Top 0.356: IC3.4 45.69,12.83 46.02,12.5 50.69,12.5 IC9.2 51.56,12.83 arc90 52.7,13.97 R11.P$1
  Top 0.61: R9.P$2 R11.P$1
OUT_P
  Top 0.356: IC3.3 45.69,11.56 46.02,11.89 50.67,11.89 51,11.56 IC9.3 51.69,11.56 arc-90 52.7,10.54 R12.P$1
  Top 0.61: R12.P$1 R10.P$2
PS_RESET  (via drill 0.35)
  Top 0.254: IC11.43 34.7,25.17 v34.67,25.15 | v34.67,20.45 44.2,20.45 47.79,16.85 R26.P$2
  Bottom 0.254: v34.67,25.15 v34.67,20.45
Q0
  Top 0.356: R34.P$2 84.55,18.96 81.03,22.48 28.32,22.48 26.67,24.13 26.67,27.3 27.18,27.81 27.18,28.57 26.8,28.96 25.82,28.96 IC11.32
Q1
  Top 0.356: R25.P$2 85.22,10.29 86.23,11.3 86.23,13.46 85.22,14.48 85.22,19.56 81.66,23.11 29.34,23.11 28.3,24.16 IC11.35
Q2
  Top 0.356: R24.P$2 85.22,9.02 87,10.79 87,13.84 85.98,14.86 85.98,19.94 82.17,23.75 29.84,23.75 29.1,24.5 IC11.36
Q3
  Top 0.356: R23.P$2 85.09,7.75 87.76,10.41 87.76,14.22 86.74,15.24 86.74,20.32 82.68,24.38 30.48,24.38 29.9,24.97 IC11.37
Q_N
  Top 0.356: IC1.20 35.96,10.52 36.05,10.62 39.88,10.62 40.21,10.29 IC3.7 40.89,10.29 arc-90 41.91,9.27 R5.P$2
  Top 0.61: R7.P$1 R5.P$2
Q_P
  Top 0.356: IC1.21 35.96,11.32 36.05,11.23 39.9,11.23 IC3.6 40.64,11.56 arc90 41.78,12.7 R8.P$1
  Top 0.61: R6.P$2 R8.P$1
RX
  Top 0.61: R32.P$2 U$44.3
  pour Top (no thermals): 58.67,31.62 58.67,33.4 58.04,33.4 56.56,32.54 58.13,31.62
SCK
  Top 0.254: IC11.9 37.21,34.54 IC8.3
SDI
  Top 0.254: IC11.10 38.71,35.33 38.86,35.18 44.07,35.18 44.45,34.8 44.45,33.91 43.81,33.27 IC8.4
TC  (via drill 0.35)
  Top 0.356: R22.P$2 82.68,12.83 83.82,13.97 83.82,18.54 80.52,21.84 27.94,21.84 v25.78,24 | v25.78,37.21 25.8,37.2 IC11.23
  Bottom 0.356: v25.78,24 v25.78,37.21
TX
  Top 0.61: R31.P$2 U$44.1
  pour Top (no thermals): 58.67,36.7 58.67,38.48 57.98,38.48 56.36,37.61 57.83,36.7
VC
  Top 0.254: IC6.1 16.41,25.56 U$48.P$1
VCC1  (via drill 0.35)
  Top 0.406: IC1.13 31.24,6.52
  Top 0.61: IC5.8 4.08,13.08
  other vias: 4.32,46.35 38.23,9.78 38.23,8.89 40.13,6.6 40.77,5.71 38.99,9.27 39.88,5.71 38.23,12.06 38.23,12.83 33.91,9.78 33.91,12.19 25.4,6.73 25.4,5.84 21.46,13.97 21.46,14.86 20.57,13.59 18.29,17.4 16.26,17.4 16.26,18.16 18.29,18.16 9.14,9.02 8.38,9.02 9.14,6.73 8.38,6.73 3.81,12.32 5.08,13.08 2.41,13.08 43.43,18.8 44.45,17.78 55.37,18.92 54.36,20.07 54.36,4.45 55.24,5.46 55.63,7.11 55.75,17.27 56.52,16.51 65.79,18.92 64.77,20.07 61.85,7.24 62.23,5.46 63.12,4.45 66.04,17.14 66.67,16.64 5.08,46.35 5.84,46.35 6.6,46.35 4.32,45.59 5.08,45.59 5.84,45.59 7.37,46.35 4.32,44.83 5.08,44.83 7.37,45.59 6.6,45.59 5.84,44.83 6.6,44.83 7.37,44.83 7.37,44.07 6.6,44.07 5.84,44.07 5.08,44.07 4.32,44.07 3.56,44.07 3.56,44.83 3.56,45.59 3.56,46.35 8.13,46.35 8.13,45.59 8.13,44.83 8.13,44.07 5.33,40.39 6.35,40.39 5.33,37.97 6.48,37.97 4.95,36.96 4.95,36.07 4.95,35.18 5.84,35.18 6.73,35.18 1.65,13.08 44.83,16 33.91,9.02 32.26,5.08 32.26,4.32 31.24,7.87 40.77,4.95 39.88,4.95 58.04,4.19 58.93,4.19 59.82,4.19 58.93,6.1 57.91,6.1 59.94,6.1
  pour Route15 (no thermals): 0,48.26 14.48,48.26 14.48,22.48 69.85,22.48 69.85,0 0,0
  pour Top (no thermals): 33.53,10.03 38.99,10.03 39.5,9.53 41.02,9.53 41.02,6.86 41.27,6.6 42.67,6.6 42.67,4.57 39.37,4.57 39.37,8.51 36.7,8.51 36.7,8.64 33.53,8.64
  pour Top (no thermals): 33.66,12.45 36.58,12.45 36.58,13.08 38.48,13.08 38.48,11.68 36.58,11.68 36.58,11.94 33.66,11.94
  pour Top (no thermals): 23.75,8.51 23.75,5.33 25.91,5.33 26.04,5.33 26.04,7.24 26.04,7.37 25.15,7.37 25.15,8.51
  pour Top (no thermals): 19.81,12.57 21.72,12.57 21.72,13.34 23.37,13.34 23.37,15.24 23.62,15.24 23.62,16.26 20.57,16.26 20.57,13.97 19.81,13.97
  pour Top (no thermals): 15.75,15.62 18.8,15.62 18.8,18.67 15.75,18.67
  pour Top (no thermals): 10.92,9.27 8.13,9.27 8.13,6.35 10.92,6.35
  pour Top (no thermals): 1.4,14.73 2.54,14.73 2.54,14.14 2.85,13.69 5.33,13.69 5.33,11.94 1.4,11.94
  pour Top (no thermals): 42.93,19.18 42.93,15.37 45.47,15.37 45.47,17.78 44.07,19.18
  pour Top (no thermals): 53.59,20.45 53.59,16.76 55.12,16.76 55.63,16.26 55.63,13.46 57.28,13.46 57.28,18.54 55.37,20.45
  pour Top (no thermals): 53.72,7.62 53.72,3.56 63.88,3.56 63.88,7.62
  pour Top (no thermals): 64.01,20.32 64.01,16.64 65.66,16.64 65.66,13.72 67.44,13.72 67.44,20.32
  pour Top (no thermals): 0.76,47.75 0.76,41.53 4.45,41.53 4.45,34.67 7.11,34.67 7.11,41.53 11.18,41.53 11.18,47.75
  pour Top (no thermals): 30.99,8.13 30.99,5.33 30.86,5.33 30.48,5.33 30.48,4.06 32.89,4.06 32.89,5.33 31.5,5.33 31.5,8.13
VCC2  (via drill 0.35)
  Top 0.254: IC10.7 IC10.10 | IC10.9 IC10.10 | IC10.10 75.56,6.48 75.56,14.1 IC10.16 | IC8.6 47.37,34.54 44.96,36.96 44.96,38.6 C24.P$2
  Top 0.356: R33.P$2 27.43,42.33 J1.2
  Top 0.61: IC11.7 38.78,32.93 C26.P$2 | IC11.28 24.37,32.13 C27.P$2
  other vias: 74.68,45.09 40.26,32.77 22.73,33.15 22.73,32.38 40.26,33.66 16.38,33.4 44.96,39.62 44.07,38.61 16.38,34.29 77.09,17.78 77.09,15.37 76.07,18.54 77.09,16.64 42.93,38.1 41.02,33.66 41.02,32.77 21.97,33.15 21.97,32.38 75.44,45.09 76.2,45.09 76.96,45.09 77.72,45.09 77.72,44.32 76.96,44.32 76.2,44.32 75.44,44.32 74.68,44.32 73.91,44.32 73.91,45.09 78.49,45.09 78.49,44.32 78.49,43.56 77.72,43.56 76.96,43.56 76.2,43.56 75.44,43.56 74.68,43.56 73.91,43.56 78.49,45.85 77.72,45.85 76.96,45.85 76.2,45.85 75.44,45.85 74.68,45.85 73.91,45.85 75.69,39.75 76.71,39.75 75.69,37.47 76.58,37.47 75.31,36.2 75.31,35.43 75.31,34.67 75.82,34.04 76.58,34.04 76.2,36.83 19.81,33.4 20.7,33.4 19.43,35.18 20.19,35.18 21.08,35.18 18.67,34.42 21.34,34.16
  pour Route15 (no thermals): 15.49,48.26 15.49,23.62 70.99,23.62 70.99,0 90.04,0 90.04,48.26
  pour Top (no thermals): 38.48,32.64 38.48,33.78 38.61,33.91 41.53,33.91 41.53,32.51 38.61,32.51
  pour Top (no thermals): 42.29,36.7 45.72,36.7 45.72,40.39 42.16,40.39 42.16,36.83
  pour Top (no thermals): 75.31,18.8 75.31,13.46 78.74,13.46 78.74,18.92 75.31,18.92
  pour Top (no thermals): 71.12,47.62 81.28,47.62 81.28,40.77 77.34,40.77 77.34,33.66 75.06,33.66 75.06,40.77 71.12,40.77
  pour Top (no thermals): 26.54,44.83 28.32,44.83 28.32,44.32 27.43,42.8 26.54,44.32
  pour Top (no thermals): 15.49,29.84 15.49,35.81 22.99,35.81 22.99,33.15 24.51,33.15 24.51,31.88 19.43,31.88 19.43,33.66 18.92,33.66 18.92,34.04 17.14,34.04 17.14,29.84
VPP
  Top 0.356: R33.P$1 25.44,44.16 J1.1
  Top 0.406: IC11.18 30.7,39.92 30.23,40.39 26.04,40.39 25.44,40.98 R33.P$1
  pour Top (no thermals): 25.59,42.86 24.07,44.39 24.77,45.09 25.65,45.09 25.65,42.93

### Text on the board
tPlace: 1 | ICSP | + | gate | TX | GND | RX | V+ | Delay-line calibration testbed | Vc | + | Yapo, 2019 | GND | f | +